# Altium schematic sheet S6M Ground Station.SchDoc: Top Sheet
size A3; SheetNumber: 1; SheetTotal: 6; DocumentName: Top Sheet
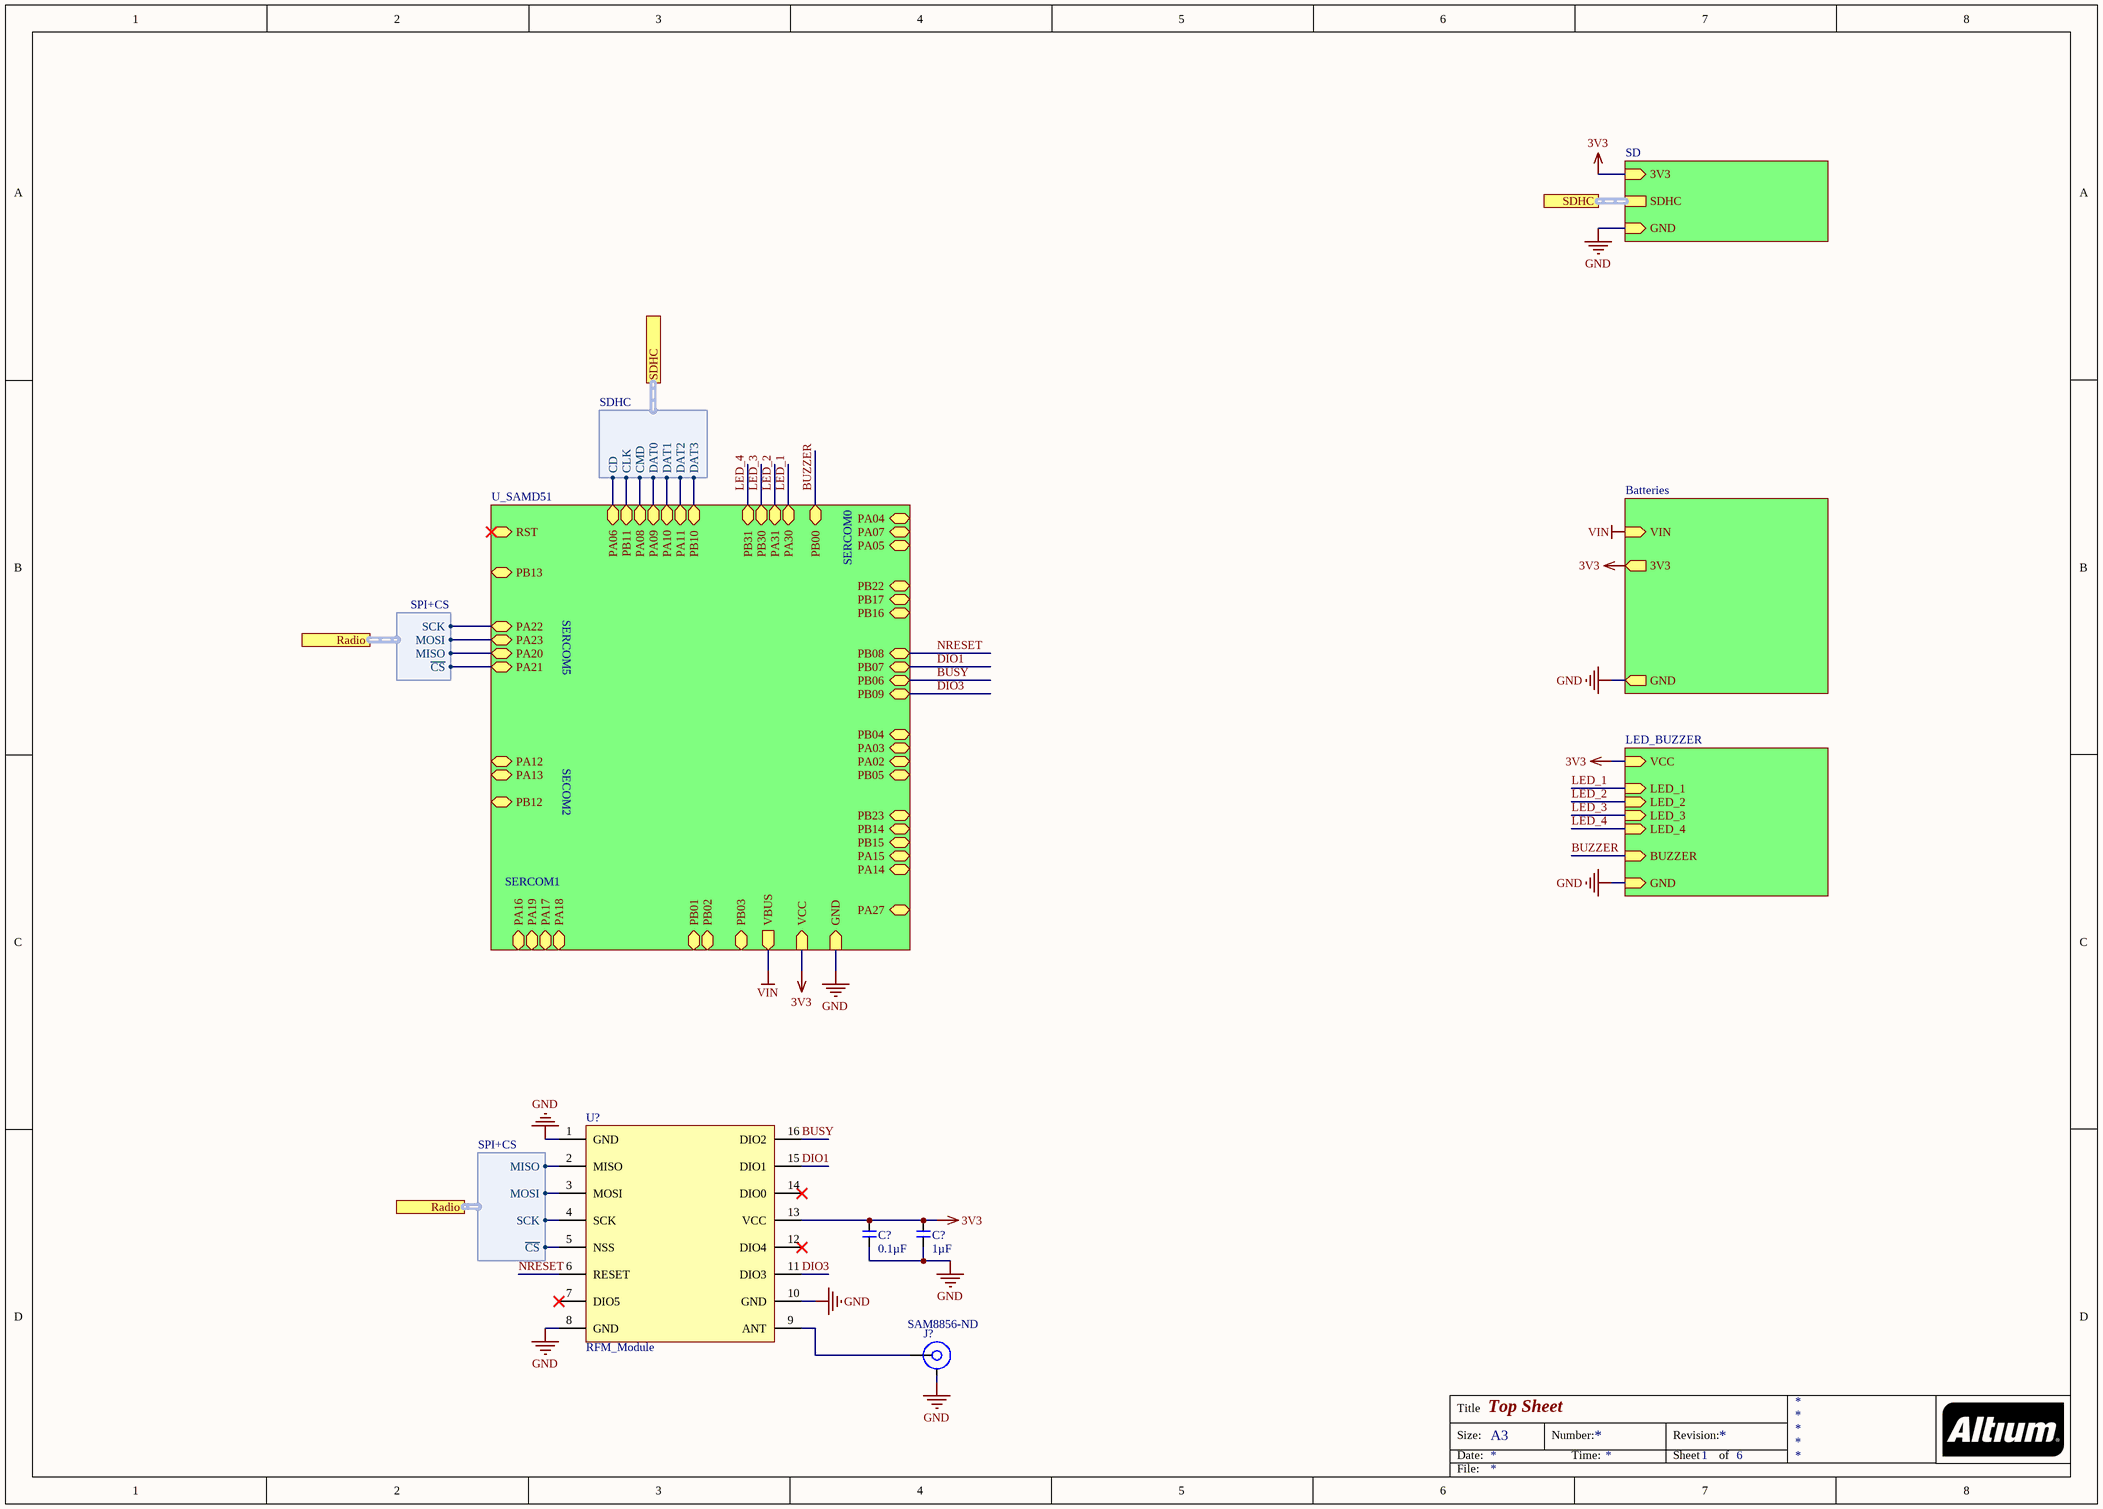
[diagram p0: S6M Ground Station.SchDoc]

## Parts
(Parts that share a designator on the sheet are numbered #1, #2 ... from top to bottom, then left to right.)
C?#1  Capacitance (shorthand): 0.1µF  [C0603]  (hidden comment: __template_cap)
C?#2  Capacitance (shorthand): 1µF  [C0603]  (hidden comment: __template_cap)
J?  Supplier Part Number 1: SAM8856-ND  [SMA_SAMTEC_SMA-J-P-X-RA-TH1]  (hidden comment: SMA_SAMTEC_TH_RA)
U?  RFM_Module  [RFM-22]

## Sub-sheets
Batteries = Battery_Management: GND (out), 3V3 (out), VIN (in)
LED_BUZZER = Blink_Blink_Beep_Boop: LED_1 (in), LED_2 (in), LED_3 (in), LED_4 (in), BUZZER (in), GND (in), VCC (in)
SD = SD.SchDoc: SDHC (harness SDHC), GND (in), 3V3 (in)
U_SAMD51 = SAMD51.SchDoc: PA12 (bidir), PA13 (bidir), PA05 (bidir), PA07 (bidir), PA04 (bidir), PA06 (bidir), PB11 (bidir), PA08 (bidir), PA09 (bidir), PA10 (bidir), PA11 (bidir), PB10 (bidir), PB12 (bidir), PB13 (bidir), PA22 (bidir), PA23 (bidir), PA16 (bidir), PA19 (bidir), PA17 (bidir), PA20 (bidir), PA21 (bidir), PB08 (bidir), PB07 (bidir), PB06 (bidir), PB09 (bidir), PB04 (bidir), PA03 (bidir), PA02 (bidir), PB05 (bidir), PB00 (bidir), PB30 (bidir), PA31 (bidir), PA30 (bidir), PB31 (bidir), PB16 (bidir), PA14 (bidir), PB17 (bidir), PB23 (bidir), PB22 (bidir), PA27 (bidir), PB02 (bidir), PB01 (bidir), PB03 (bidir), PA18 (bidir), GND (in), VCC (in), VBUS (out), PB14 (bidir), PB15 (bidir), PA15 (bidir), RST (bidir)

## Ports
Radio (harness SPI+CS), SDHC, SDHC (harness SDHC)

## Harnesses
SDHC: CD, CLK, CMD, DAT0, DAT1, DAT2, DAT3
SPI+CS: MISO, MOSI, SCK, ~{CS}

## Nets
3V3: C?#1.1 C?#2.1 U?.13(VCC) ; sheet Batteries/3V3, sheet LED_BUZZER/VCC, sheet SD/3V3, sheet U_SAMD51/VCC
GND: C?#1.2 C?#2.2 J?.GND U?.1(GND) U?.8(GND) U?.10(GND) ; sheet Batteries/GND, sheet LED_BUZZER/GND, sheet SD/GND, sheet U_SAMD51/GND
VIN: sheet Batteries/VIN, sheet U_SAMD51/VBUS
BUSY: U?.16(DIO2) ; sheet U_SAMD51/PB06
BUZZER: sheet LED_BUZZER/BUZZER, sheet U_SAMD51/PB00
DIO1: U?.15(DIO1) ; sheet U_SAMD51/PB07
DIO3: U?.11(DIO3) ; sheet U_SAMD51/PB09
LED_1: sheet LED_BUZZER/LED_1, sheet U_SAMD51/PA30
LED_2: sheet LED_BUZZER/LED_2, sheet U_SAMD51/PA31
LED_3: sheet LED_BUZZER/LED_3, sheet U_SAMD51/PB30
LED_4: sheet LED_BUZZER/LED_4, sheet U_SAMD51/PB31
NRESET: U?.6(RESET) ; sheet U_SAMD51/PB08
NetJ?_SIG: J?.SIG U?.9(ANT)
NetU?_2: U?.2(MISO) ; sheet U_SAMD51/PA20, port Radio.MISO
NetU?_3: U?.3(MOSI) ; sheet U_SAMD51/PA23, port Radio.MOSI
NetU?_4: U?.4(SCK) ; sheet U_SAMD51/PA22, port Radio.SCK
NetU?_5: U?.5(NSS) ; sheet U_SAMD51/PA21, port Radio.~{CS}
(unnamed): sheet U_SAMD51/PA06, port SDHC.CD
(unnamed): sheet U_SAMD51/PB11, port SDHC.CLK
(unnamed): sheet U_SAMD51/PA08, port SDHC.CMD
(unnamed): sheet U_SAMD51/PA09, port SDHC.DAT0
(unnamed): sheet U_SAMD51/PA10, port SDHC.DAT1
(unnamed): sheet U_SAMD51/PA11, port SDHC.DAT2
(unnamed): sheet U_SAMD51/PB10, port SDHC.DAT3

Not connected (* = marked no-connect by the designer): U? 7(DIO5)* 12(DIO4)* 14(DIO0)*

## Buses and harness runs
harness port SDHC = sheet SD/SDHC

## Notes on the sheet
- SERCOM0
- SERCOM5
- SECOM2
- SERCOM1
- Title
- Size:
- Date:
- A3
- Number:
- Time:
- Revision:
- Sheet
- of
- File:

## Library data of the parts
C?#1 = 490-1519-1-ND: CAP CER 0603 0.1µF X7R 50V 10%; Manufacturer: Murata Electronics North America; Capacitance - pF (Machine readable): #NAME?; type: capacitor; Rated Voltage: 50V; Supplier Part Number 1: 490-1519-1-ND; Dielectric: X7R; Supplier 1: Digikey
C?#2 = 490-3900-1-ND: CAP CER 0603 1µF X7R 16V 10%; Manufacturer: Murata Electronics North America; Capacitance - pF (Machine readable): #NAME?; type: capacitor; Rated Voltage: 16V; Supplier Part Number 1: 490-3900-1-ND; Dielectric: X7R; Supplier 1: Digikey
J? = SMA_SAMTEC_TH_RA: Supplier 1: Digi-Key